# Altium project MC.1.0.0.PrjPcb
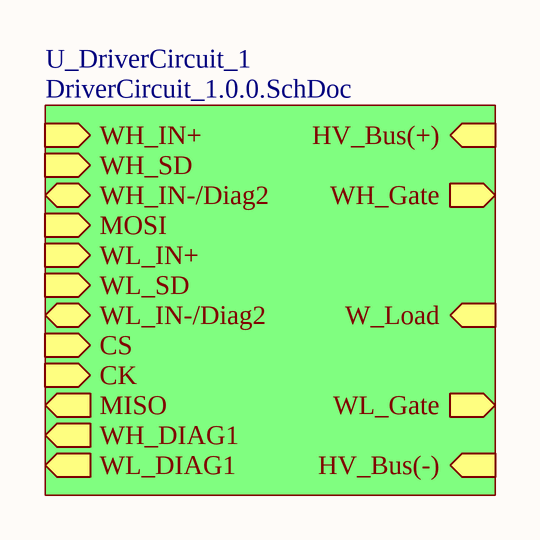
[diagram p0: MC.1.0.0.SchDoc]
3 sheets, 56 parts. Net scope: hierarchical (ports join the sheet entries above them; power ports are global).
Board file: DriverBoard_1.0.0.PcbDoc
Sheets:
  MC.1.0.0.SchDoc
    U_DriverCircuit_1 = DriverCircuit_1.0.0.SchDoc
  SPC56_ControllerBoard_1.0.0.SchDoc

## Sheet MC.1.0.0.SchDoc
size A

### Sub-sheets
U_DriverCircuit_1 = DriverCircuit_1.0.0.SchDoc: WH_IN+ (in), WH_SD (in), WH_DIAG1 (out), WH_IN-/Diag2 (bidir), MOSI (in), WL_IN+ (in), WL_SD (in), WL_DIAG1 (out), WL_IN-/Diag2 (bidir), MISO (out), CS (in), CK (in), W_Load (in), WH_Gate (out), HV_Bus(+) (in), HV_Bus(-) (in), WL_Gate (out)

## Sheet DriverCircuit_1.0.0.SchDoc
size Letter
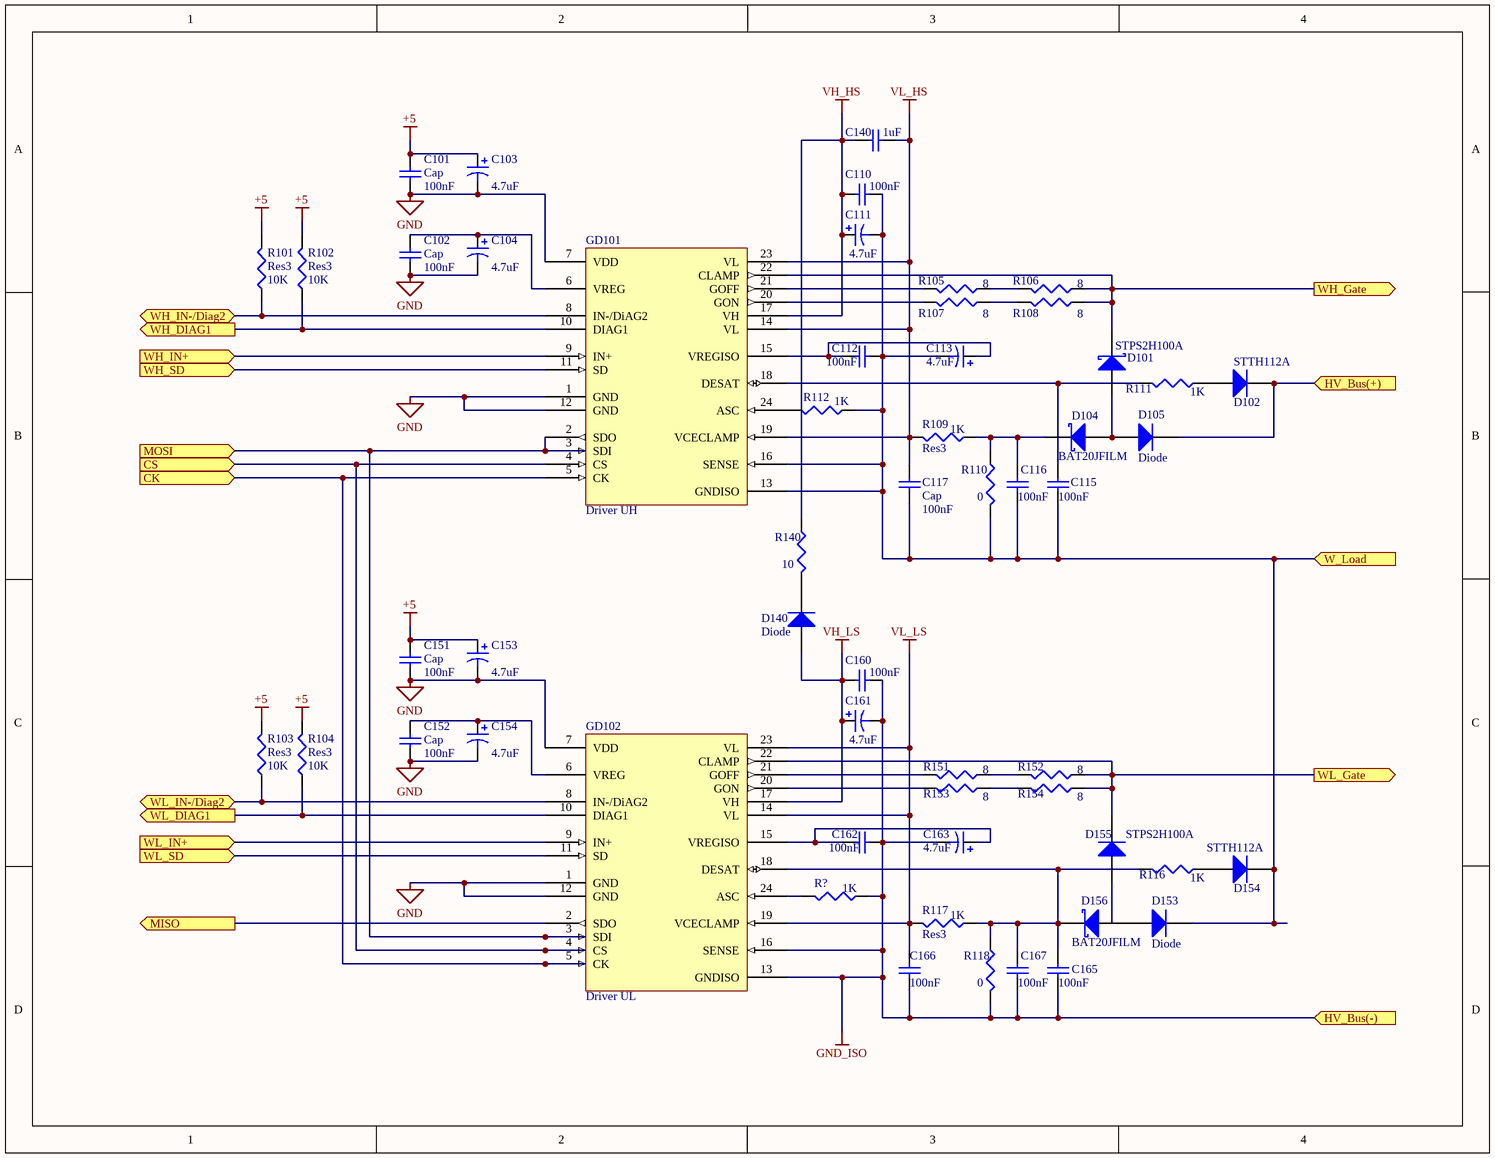
[diagram p1: DriverCircuit_1.0.0.SchDoc]

### Parts
C101  Cap  value 100nF  [C1206]
C102  Cap  value 100nF  [C1206]
C103  value 4.7uF  [1812]
C104  value 4.7uF  [1812]
C110  value 100nF  [C1206]  (hidden comment: Cap)
C111  value 4.7uF  [1812]
C112  value 100nF  [C1206]  (hidden comment: Cap)
C113  value 4.7uF  [1812]
C115  value 100nF  [C1206]  (hidden comment: Cap)
C116  value 100nF  [C1206]  (hidden comment: Cap)
C117  Cap  value 100nF  [C1206]
C140  value 1uF  [C1206]  (hidden comment: Cap)
C151  Cap  value 100nF  [C1206]
C152  Cap  value 100nF  [C1206]
C153  value 4.7uF  [1812]
C154  value 4.7uF  [1812]
C160  value 100nF  [C1206]  (hidden comment: Cap)
C161  value 4.7uF  [1812]
C162  value 100nF  [C1206]  (hidden comment: Cap)
C163  value 4.7uF  [1812]
C165  value 100nF  [C1206]  (hidden comment: Cap)
C166  value 100nF  [C1206]
C167  value 100nF  [C1206]  (hidden comment: Cap)
D101  STPS2H100A  [SMB]
D102  STTH112A  [SMC]
D104  BAT20JFILM  [SMB]
D105  Diode  [SMC]
D140  Diode  [SMC]
D153  Diode  [SMC]
D154  STTH112A  [SMC]
D155  STPS2H100A  [SMC]
D156  BAT20JFILM  [SMB]
GD101  Driver UH  [SO24W]
GD102  Driver UL  [SO24W]
R101  Res3  value 10K  [J1-0603]
R102  Res3  value 10K  [J1-0603]
R103  Res3  value 10K  [J1-0603]
R104  Res3  value 10K  [J1-0603]
R105  value 8  [J1-0603]  (hidden comment: Res3)
R106  value 8  [J1-0603]  (hidden comment: Res3)
R107  value 8  [J1-0603]  (hidden comment: Res3)
R108  value 8  [J1-0603]  (hidden comment: Res3)
R109  Res3  value 1K  [J1-0603]
R110  value 0  [J1-0603]  (hidden comment: Res3)
R111  value 1K  [J1-0603]  (hidden comment: Res3)
R112  value 1K  [J1-0603]
R116  value 1K  [J1-0603]  (hidden comment: Res3)
R117  Res3  value 1K  [J1-0603]
R118  value 0  [J1-0603]  (hidden comment: Res3)
R140  value 10  [J1-0603]  (hidden comment: Res3)
R151  value 8  [J1-0603]  (hidden comment: Res3)
R152  value 8  [J1-0603]  (hidden comment: Res3)
R153  value 8  [J1-0603]  (hidden comment: Res3)
R154  value 8  [J1-0603]  (hidden comment: Res3)
R?  value 1K  [J1-0603]

### Ports
CK (in), CS (in), HV_Bus(+) (in), HV_Bus(-) (in), MISO (out), MOSI (in), W_Load (in), WH_DIAG1 (out), WH_Gate (out), WH_IN+ (in), WH_IN-/Diag2 (bidir), WH_SD (in), WL_DIAG1 (out), WL_Gate (out), WL_IN+ (in), WL_IN-/Diag2 (bidir), WL_SD (in)

### Nets
+5: C101.2 C103.1 C151.2 C153.1 R101.2 R102.2 R103.2 R104.2
GND: C101.1 C102.1 C103.2 C104.2 C151.1 C152.1 C153.2 C154.2 GD101.1(GND) GD101.7(VDD) GD101.12(GND) GD102.1(GND) GD102.7(VDD) GD102.12(GND)
GND_ISO: C160.2 C161.2 C162.2 C163.2 C165.1 C166.1 C167.1 GD102.13(GNDISO) GD102.16(SENSE) R118.2 R?.1 ; port HV_Bus(-)
VH_HS: C110.1 C111.1 C140.1 GD101.17(VH) R140.1
VH_LS: C160.1 C161.1 D140.1(A) GD102.17(VH)
VL_HS: C117.2 C140.2 GD101.14(VL) GD101.19(VCECLAMP) GD101.23(VL) R109.2
VL_LS: C166.2 GD102.14(VL) GD102.19(VCECLAMP) GD102.23(VL) R117.2
NetC102_2: C102.2 C104.1 GD101.6(VREG)
NetC110_2: C110.2 C111.2 C112.2 C113.2 C115.1 C116.1 C117.1 D153.2(K) D154.2(K) GD101.13(GNDISO) GD101.16(SENSE) R110.2 R112.1 ; port W_Load
NetC112_1: C112.1 C113.1 GD101.15(VREGISO)
NetC115_2: C115.2 GD101.18(DESAT) R111.2
NetC116_2: C116.2 D104.2(K) R109.1 R110.1
NetC152_2: C152.2 C154.1 GD102.6(VREG)
NetC162_1: C162.1 C163.1 GD102.15(VREGISO)
NetC165_2: C165.2 C167.2 D156.2(K) GD102.18(DESAT) R116.2 R117.1 R118.1
NetD101_1: D101.1(A) D104.1(A) D105.1(A)
NetD101_2: D101.2(K) GD101.22(CLAMP) R106.1 R108.1 ; port WH_Gate
NetD102_1: D102.1(A) R111.1
NetD102_2: D102.2(K) D105.2(K) ; port HV_Bus(+)
NetD140_2: D140.2(K) R140.2
NetD153_1: D153.1(A) D156.1(A)
NetD154_1: D154.1(A) R116.1
NetD155_2: D155.2(K) GD102.22(CLAMP) R152.1 R154.1 ; port WL_Gate
NetGD101_2: GD101.2(SDO) GD101.3(SDI) GD102.3(SDI) ; port MOSI
NetGD101_4: GD101.4(CS) GD102.4(CS) ; port CS
NetGD101_5: GD101.5(CK) GD102.5(CK) ; port CK
NetGD101_8: GD101.8(IN-/DiAG2) R101.1 ; port WH_IN-/Diag2
NetGD101_9: GD101.9(IN+) ; port WH_IN+
NetGD101_10: GD101.10(DIAG1) R102.1 ; port WH_DIAG1
NetGD101_11: GD101.11(SD) ; port WH_SD
NetGD101_20: GD101.20(GON) R107.2
NetGD101_21: GD101.21(GOFF) R105.2
NetGD101_24: GD101.24(ASC) R112.2
NetGD102_2: GD102.2(SDO) ; port MISO
NetGD102_8: GD102.8(IN-/DiAG2) R103.1 ; port WL_IN-/Diag2
NetGD102_9: GD102.9(IN+) ; port WL_IN+
NetGD102_10: GD102.10(DIAG1) R104.1 ; port WL_DIAG1
NetGD102_11: GD102.11(SD) ; port WL_SD
NetGD102_20: GD102.20(GON) R153.2
NetGD102_21: GD102.21(GOFF) R151.2
NetGD102_24: GD102.24(ASC) R?.2
NetR105_1: R105.1 R106.2
NetR107_1: R107.1 R108.2
NetR151_1: R151.1 R152.2
NetR153_1: R153.1 R154.2

Not connected (* = marked no-connect by the designer): D155 1(A)

### Library data of the parts
C101 C102 C110 C112 C115-C117 C151 C152 C160 C162 C165-C167 = Cap Semi: Capacitor (Semiconductor SIM Model); Published: 8-Jun-2000; LatestRevisionDate: 29-May-2009; LatestRevisionNote: IPC-7351 Footprint Added.; PackageReference: C1206; Publisher: Altium Limited; PackageDescription: Chip Capacitor
C103 C104 C111 C113 C153 C154 C161 C163 = Cap Pol3: Polarized Capacitor (Surface Mount); Published: 8-Jun-2000; LatestRevisionDate: 29-May-2009; LatestRevisionNote: IPC-7351 Footprint Added.; PackageReference: C0805; Publisher: Altium Limited; PackageDescription: Chip Capacitor
C140 = Cap Semi: CBoot; Published: 8-Jun-2000; LatestRevisionDate: 29-May-2009; LatestRevisionNote: IPC-7351 Footprint Added.; PackageReference: C1206; Publisher: Altium Limited; PackageDescription: Chip Capacitor
D101 D104 D156 = D Schottky: Schottky Diode; Published: 8-Jun-2000; LatestRevisionDate: 17-Jul-2002; LatestRevisionNote: Re-released for DXP Platform.; PackageReference: SMB; Publisher: Altium Limited; PackageDescription: DO-214-AA/SMB; 2 C-Bend Leads; Body 5.3 x 3.6 mm, inc. leads (LxW); Code_JEDEC: DO-214-AA
D102 D105 D153-D155 = Diode: Default Diode; Published: 8-Jun-2000; LatestRevisionDate: 17-Jul-2002; LatestRevisionNote: Re-released for DXP Platform.; PackageVersion: Sep-1996; PackageReference: SMC; Publisher: Altium Limited; PackageDescription: DO-214-AB/SMC; 2 C-Bend Leads; Body 7.9 x 5.9 mm, inc. leads (LxW); Code_JEDEC: DO-214-AB
D140 = Diode: DBoot; Published: 8-Jun-2000; LatestRevisionDate: 17-Jul-2002; LatestRevisionNote: Re-released for DXP Platform.; PackageVersion: Sep-1996; PackageReference: SMC; Publisher: Altium Limited; PackageDescription: DO-214-AB/SMC; 2 C-Bend Leads; Body 7.9 x 5.9 mm, inc. leads (LxW); Code_JEDEC: DO-214-AB
GD101 GD102 = Component_1
R101-R112 R116-R118 R151-R154 R? = Res3: Resistor; Published: 8-Jun-2000; LatestRevisionDate: 29-May-2009; LatestRevisionNote: IPC-7351 Footprint Added.; PackageReference: J1-0603; Publisher: Altium Limited; PackageDescription: Chip Resistor
R140 = Res3: RBoot; Published: 8-Jun-2000; LatestRevisionDate: 29-May-2009; LatestRevisionNote: IPC-7351 Footprint Added.; PackageReference: J1-0603; Publisher: Altium Limited; PackageDescription: Chip Resistor

## Sheet SPC56_ControllerBoard_1.0.0.SchDoc
size 381 x 508 mm
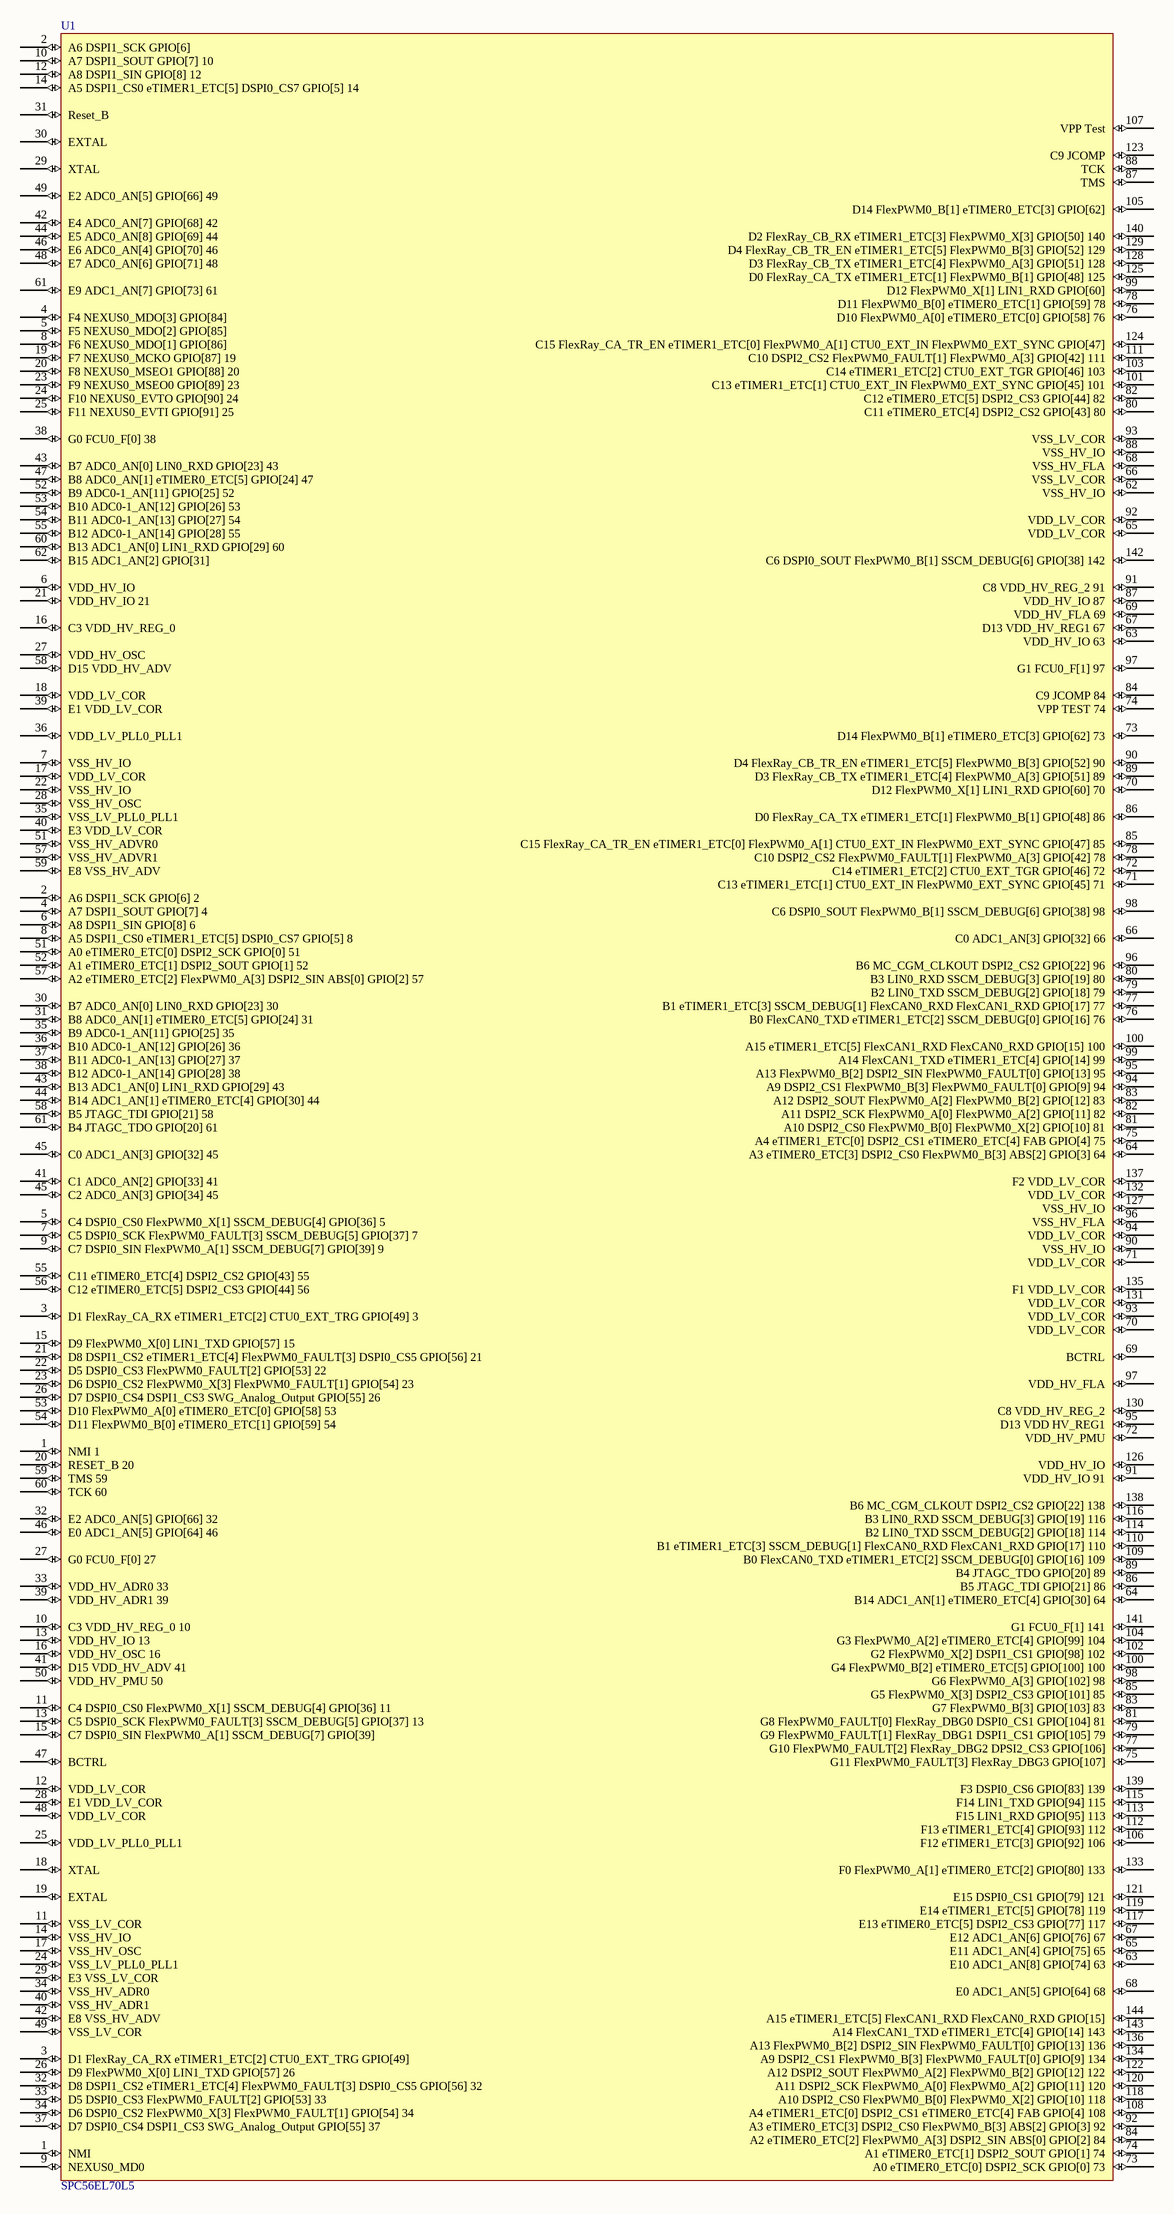
[diagram p2: SPC56_ControllerBoard_1.0.0.SchDoc]

### Parts
U1  SPC56EL70L5  [CQFP50P2200X2200X160-144N]

### Nets

Not connected (* = marked no-connect by the designer): U1 1(NMI) 2(A6_DSPI1_SCK_GPIO[6]) 3(D1_FlexRay_CA_RX_eTIMER1_ETC[2]_CTU0_EXT_TRG_GPIO[49]) 4(F4_NEXUS0_MDO[3]_GPIO[84]) 5(F5_NEXUS0_MDO[2]_GPIO[85]) 6(VDD_HV_IO) 7(VSS_HV_IO) 8(F6_NEXUS0_MDO[1]_GPIO[86]) 9(NEXUS0_MD0) 10(A7_DSPI1_SOUT_GPIO[7]_10) 11(C4_DSPI0_CS0_FlexPWM0_X[1]_SSCM_DEBUG[4]_GPIO[36]_11) 12(A8_DSPI1_SIN_GPIO[8]_12) 13(C5_DSPI0_SCK_FlexPWM0_FAULT[3]_SSCM_DEBUG[5]_GPIO[37]_13) 14(A5_DSPI1_CS0_eTIMER1_ETC[5]_DSPI0_CS7_GPIO[5]_14) 15(C7_DSPI0_SIN_FlexPWM0_A[1]_SSCM_DEBUG[7]_GPIO[39]) 16(C3_VDD_HV_REG_0) 17(VDD_LV_COR) 18(VDD_LV_COR) 19(F7_NEXUS0_MCKO_GPIO[87]_19) 20(F8_NEXUS0_MSEO1_GPIO[88]_20) 21(VDD_HV_IO_21) 22(VSS_HV_IO) 23(F9_NEXUS0_MSEO0_GPIO[89]_23) 24(F10_NEXUS0_EVTO_GPIO[90]_24) 25(F11_NEXUS0_EVTI_GPIO[91]_25) 26(D9_FlexPWM0_X[0]_LIN1_TXD_GPIO[57]_26) 27(VDD_HV_OSC) 28(VSS_HV_OSC) 29(XTAL) 30(EXTAL) 31(Reset_B) 32(D8_DSPI1_CS2_eTIMER1_ETC[4]_FlexPWM0_FAULT[3]_DSPI0_CS5_GPIO[56]_32) 33(D5_DSPI0_CS3_FlexPWM0_FAULT[2]_GPIO[53]_33) 34(D6_DSPI0_CS2_FlexPWM0_X[3]_FlexPWM0_FAULT[1]_GPIO[54]_34) 35(VSS_LV_PLL0_PLL1) 36(VDD_LV_PLL0_PLL1) 37(D7_DSPI0_CS4_DSPI1_CS3_SWG_Analog_Output_GPIO[55]_37) 38(G0_FCU0_F[0]_38) 39(E1_VDD_LV_COR) 40(E3_VDD_LV_COR) 41(C1_ADC0_AN[2]_GPIO[33]_41) 42(E4_ADC0_AN[7]_GPIO[68]_42) 43(B7_ADC0_AN[0]_LIN0_RXD_GPIO[23]_43) 44(E5_ADC0_AN[8]_GPIO[69]_44) 45(C2_ADC0_AN[3]_GPIO[34]_45) 46(E6_ADC0_AN[4]_GPIO[70]_46) 47(B8_ADC0_AN[1]_eTIMER0_ETC[5]_GPIO[24]_47) 48(E7_ADC0_AN[6]_GPIO[71]_48) 49(E2_ADC0_AN[5]_GPIO[66]_49) 50(VDD_HV_PMU_50) 51(VSS_HV_ADVR0) 52(B9_ADC0-1_AN[11]_GPIO[25]_52) 53(B10_ADC0-1_AN[12]_GPIO[26]_53) 54(B11_ADC0-1_AN[13]_GPIO[27]_54) 55(B12_ADC0-1_AN[14]_GPIO[28]_55) 56(C12_eTIMER0_ETC[5]_DSPI2_CS3_GPIO[44]_56) 57(VSS_HV_ADVR1) 58(D15_VDD_HV_ADV) 59(E8_VSS_HV_ADV) 60(B13_ADC1_AN[0]_LIN1_RXD_GPIO[29]_60) 61(E9_ADC1_AN[7]_GPIO[73]_61) 62(B15_ADC1_AN[2]_GPIO[31]) 63(E10_ADC1_AN[8]_GPIO[74]_63) 64(B14_ADC1_AN[1]_eTIMER0_ETC[4]_GPIO[30]_64) 65(E11_ADC1_AN[4]_GPIO[75]_65) 66(C0_ADC1_AN[3]_GPIO[32]_66) 67(E12_ADC1_AN[6]_GPIO[76]_67) 68(E0_ADC1_AN[5]_GPIO[64]_68) 69(BCTRL) 70(VDD_LV_COR) 71(VDD_LV_COR) 72(VDD_HV_PMU) 73(A0_eTIMER0_ETC[0]_DSPI2_SCK_GPIO[0]_73) 74(A1_eTIMER0_ETC[1]_DSPI2_SOUT_GPIO[1]_74) 75(G11_FlexPWM0_FAULT[3]_FlexRay_DBG3_GPIO[107]) 76(D10_FlexPWM0_A[0]_eTIMER0_ETC[0]_GPIO[58]_76) 77(G10_FlexPWM0_FAULT[2]_FlexRay_DBG2_DPSI2_CS3_GPIO[106]) 78(D11_FlexPWM0_B[0]_eTIMER0_ETC[1]_GPIO[59]_78) 79(G9_FlexPWM0_FAULT[1]_FlexRay_DBG1_DSPI1_CS1_GPIO[105]_79) 80(C11_eTIMER0_ETC[4]_DSPI2_CS2_GPIO[43]_80) 81(G8_FlexPWM0_FAULT[0]_FlexRay_DBG0_DSPI0_CS1_GPIO[104]_81) 82(C12_eTIMER0_ETC[5]_DSPI2_CS3_GPIO[44]_82) 83(G7_FlexPWM0_B[3]_GPIO[103]_83) 84(A2_eTIMER0_ETC[2]_FlexPWM0_A[3]_DSPI2_SIN_ABS[0]_GPIO[2]_84) 85(G5_FlexPWM0_X[3]_DSPI2_CS3_GPIO[101]_85) 86(B5_JTAGC_TDI_GPIO[21]_86) 87(TMS) 88(TCK) 89(B4_JTAGC_TDO_GPIO[20]_89) 90(VSS_HV_IO) 91(VDD_HV_IO_91) 92(A3_eTIMER0_ETC[3]_DSPI2_CS0_FlexPWM0_B[3]_ABS[2]_GPIO[3]_92) 93(VDD_LV_COR) 94(VDD_LV_COR) 95(D13_VDD_HV_REG1) 96(VSS_HV_FLA) 97(VDD_HV_FLA) 98(G6_FlexPWM0_A[3]_GPIO[102]_98) 99(D12_FlexPWM0_X[1]_LIN1_RXD_GPIO[60]) 100(G4_FlexPWM0_B[2]_eTIMER0_ETC[5]_GPIO[100]_100) 101(C13_eTIMER1_ETC[1]_CTU0_EXT_IN_FlexPWM0_EXT_SYNC_GPIO[45]_101) 102(G2_FlexPWM0_X[2]_DSPI1_CS1_GPIO[98]_102) 103(C14_eTIMER1_ETC[2]_CTU0_EXT_TGR_GPIO[46]_103) 104(G3_FlexPWM0_A[2]_eTIMER0_ETC[4]_GPIO[99]_104) 105(D14_FlexPWM0_B[1]_eTIMER0_ETC[3]_GPIO[62]) 106(F12_eTIMER1_ETC[3]_GPIO[92]_106) 107(VPP_Test) 108(A4_eTIMER1_ETC[0]_DSPI2_CS1_eTIMER0_ETC[4]_FAB_GPIO[4]_108) 109(B0_FlexCAN0_TXD_eTIMER1_ETC[2]_SSCM_DEBUG[0]_GPIO[16]_109) 110(B1_eTIMER1_ETC[3]_SSCM_DEBUG[1]_FlexCAN0_RXD_FlexCAN1_RXD_GPIO[17]_110) 111(C10_DSPI2_CS2_FlexPWM0_FAULT[1]_FlexPWM0_A[3]_GPIO[42]_111) 112(F13_eTIMER1_ETC[4]_GPIO[93]_112) 113(F15_LIN1_RXD_GPIO[95]_113) 114(B2_LIN0_TXD_SSCM_DEBUG[2]_GPIO[18]_114) 115(F14_LIN1_TXD_GPIO[94]_115) 116(B3_LIN0_RXD_SSCM_DEBUG[3]_GPIO[19]_116) 117(E13_eTIMER0_ETC[5]_DSPI2_CS3_GPIO[77]_117) 118(A10_DSPI2_CS0_FlexPWM0_B[0]_FlexPWM0_X[2]_GPIO[10]_118) 119(E14_eTIMER1_ETC[5]_GPIO[78]_119) 120(A11_DSPI2_SCK_FlexPWM0_A[0]_FlexPWM0_A[2]_GPIO[11]_120) 121(E15_DSPI0_CS1_GPIO[79]_121) 122(A12_DSPI2_SOUT_FlexPWM0_A[2]_FlexPWM0_B[2]_GPIO[12]_122) 123(C9_JCOMP) 124(C15_FlexRay_CA_TR_EN_eTIMER1_ETC[0]_FlexPWM0_A[1]_CTU0_EXT_IN_FlexPWM0_EXT_SYNC_GPIO[47]) 125(D0_FlexRay_CA_TX_eTIMER1_ETC[1]_FlexPWM0_B[1]_GPIO[48]_125) 126(VDD_HV_IO) 127(VSS_HV_IO) 128(D3_FlexRay_CB_TX_eTIMER1_ETC[4]_FlexPWM0_A[3]_GPIO[51]_128) 129(D4_FlexRay_CB_TR_EN_eTIMER1_ETC[5]_FlexPWM0_B[3]_GPIO[52]_129) 130(C8_VDD_HV_REG_2) 131(VDD_LV_COR) 132(VDD_LV_COR) 133(F0_FlexPWM0_A[1]_eTIMER0_ETC[2]_GPIO[80]_133) 134(A9_DSPI2_CS1_FlexPWM0_B[3]_FlexPWM0_FAULT[0]_GPIO[9]_134) 135(F1_VDD_LV_COR) 136(A13_FlexPWM0_B[2]_DSPI2_SIN_FlexPWM0_FAULT[0]_GPIO[13]_136) 137(F2_VDD_LV_COR) 138(B6_MC_CGM_CLKOUT_DSPI2_CS2_GPIO[22]_138) 139(F3_DSPI0_CS6_GPIO[83]_139) 140(D2_FlexRay_CB_RX_eTIMER1_ETC[3]_FlexPWM0_X[3]_GPIO[50]_140) 141(G1_FCU0_F[1]_141) 142(C6_DSPI0_SOUT_FlexPWM0_B[1]_SSCM_DEBUG[6]_GPIO[38]_142) 143(A14_FlexCAN1_TXD_eTIMER1_ETC[4]_GPIO[14]_143) 144(A15_eTIMER1_ETC[5]_FlexCAN1_RXD_FlexCAN0_RXD_GPIO[15])

### Library data of the parts
U1 = SPC56EL70L5 DIP